# EAGLE design untitled (EAGLE 8.6.1)
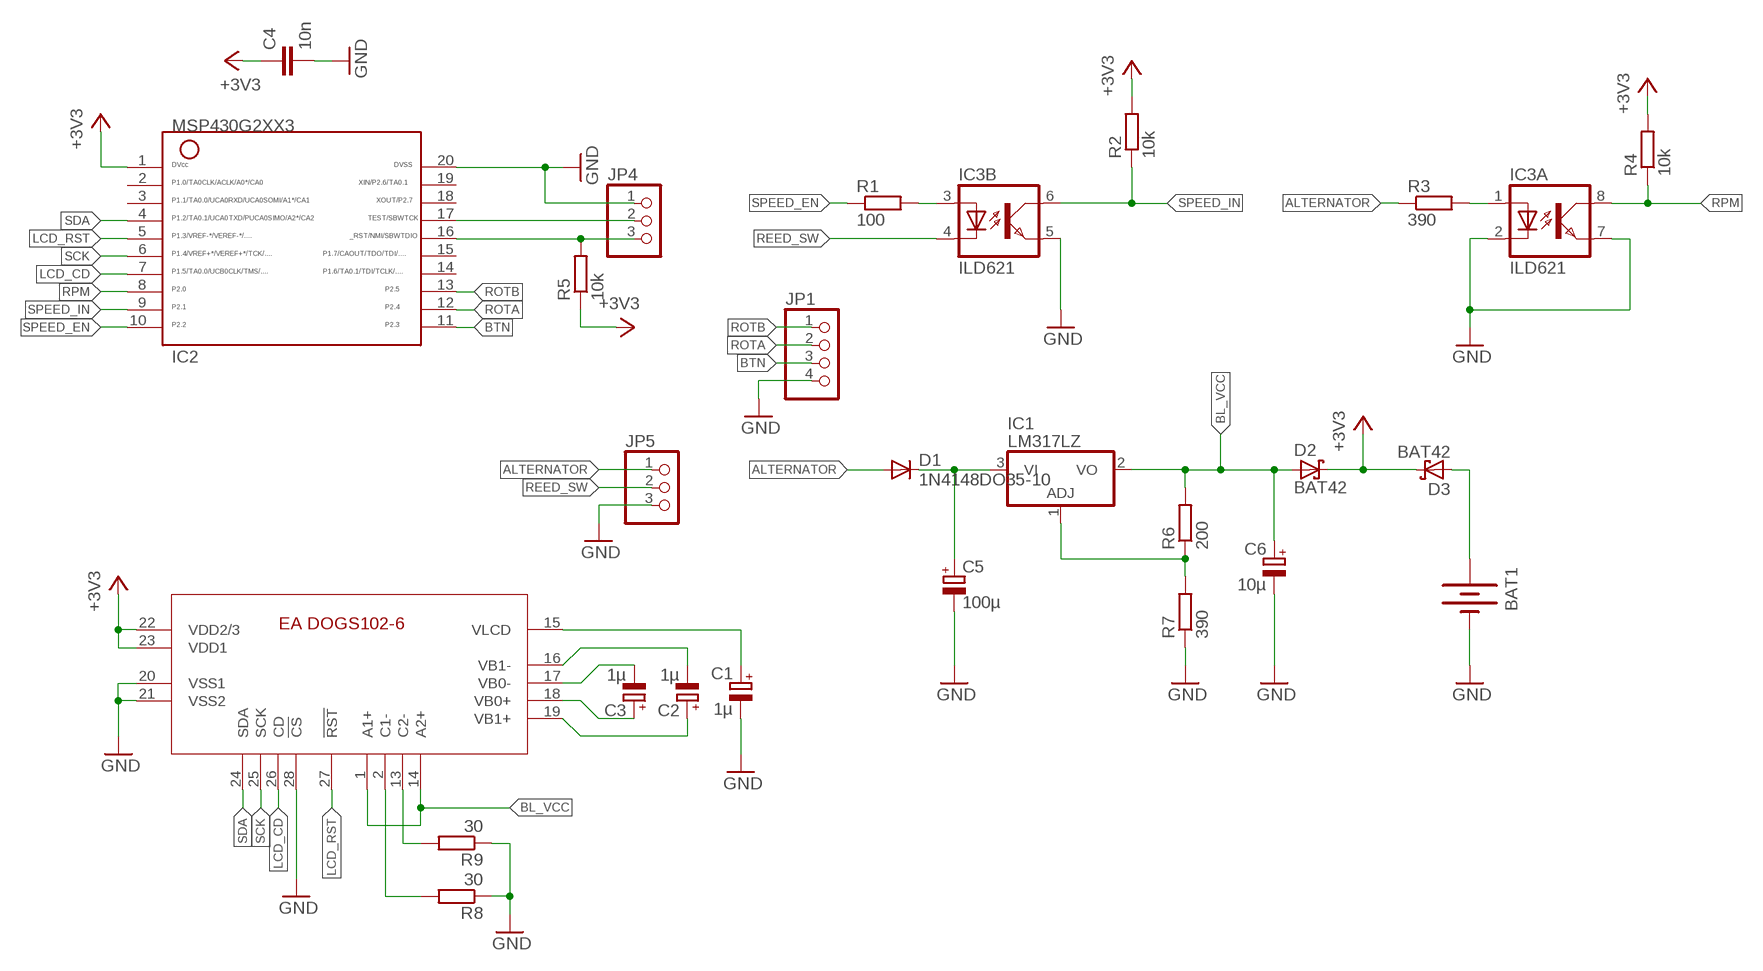
[diagram p0: schematic, sheet 1]

## Parts
BAT1  BATTERY20PTH  [BATTCOM_20MM_PTH]
C1  1µ  CPOL-EUE2-4  [E2-4]
C2  1µ  CPOL-EUE2-4  [E2-4]
C3  1µ  CPOL-EUE2-4  [E2-4]
C4  10n  C-EU050-024X044  [C050-024X044]
C5  100µ  CPOL-EUE2,5-6E  [E2,5-6E]
C6  10µ  CPOL-EUE2-4  [E2-4]
D1  1N4148DO35-10  [DO35-10]
D2  BAT42  [DO35-10]
D3  BAT42  [DO35-10]
IC1  LM317LZ  [TO92]
IC2  G2XX3---N20  [N20]
IC3  ILD621  [DIL08]
JP1  PINHD-1X4  [1X04]
JP4  PINHD-1X3  [1X03]
JP5  PINHD-1X3  [1X03]
R1  100  R-EU_0204/7  [0204/7]
R2  10k  R-EU_0204/7  [0204/7]
R3  390  R-EU_0204/7  [0204/7]
R4  10k  R-EU_0204/7  [0204/7]
R5  10k  R-EU_0204/7  [0204/7]
R6  200  R-EU_0204/7  [0204/7]
R7  390  R-EU_0204/7  [0204/7]
R8  30  R-EU_0204/7  [0204/7]
R9  30  R-EU_0204/7  [0204/7]
U$1  EA-DOG102-6  [EA_DOGS102-6]

## Nets
+3V3: C4.1 D2.C D3.C IC2.1 R2.2 R4.2 R5.1 U$1.22(VDD2/3) U$1.23(VDD1)
ALTERNATOR: D1.A JP5.1 R3.1
BL_VCC: C6.+ D2.A IC1.2(VO) R6.2 U$1.1(A1+) U$1.14(A2+)
BTN: IC2.11 JP1.3
GND: BAT1.2(-) C1.- C4.2 C5.- C6.- IC2.20 IC3.2(A:C) IC3.5(B:EMIT) IC3.7(A:EMIT) JP1.4 JP4.1 JP5.3 R7.1 R8.1 R9.1 U$1.20(VSS1) U$1.21(VSS2) U$1.28(!CS!)
LCD_CD: IC2.7 U$1.26(CD)
LCD_RST: IC2.5 U$1.27(!RST!)
N$3: IC2.16 JP4.3 R5.2
N$4: IC2.17 JP4.2
N$5: C1.+ U$1.15(VLCD)
N$6: IC3.3(B:A) R1.2
N$7: C3.- U$1.17(VB0-)
N$8: C3.+ U$1.18(VB0+)
N$9: C2.- U$1.16(VB1-)
N$10: IC1.1(ADJ) R6.1 R7.2
N$12: C5.+ D1.C IC1.3(VI)
N$14: BAT1.1(+) D3.A
N$15: IC3.1(A:A) R3.2
N$18: C2.+ U$1.19(VB1+)
N$19: R8.2 U$1.2(C1-)
N$20: R9.2 U$1.13(C2-)
REED_SW: IC3.4(B:C) JP5.2
ROTA: IC2.12 JP1.2
ROTB: IC2.13 JP1.1
RPM: IC2.8 IC3.8(A:COL) R4.1
SCK: IC2.6 U$1.25(SCK)
SDA: IC2.4 U$1.24(SDA)
SPEED_EN: IC2.10 R1.1
SPEED_IN: IC2.9 IC3.6(B:COL) R2.1
Unconnected: IC2.2 IC2.3 IC2.14 IC2.15 IC2.18 IC2.19

## Library data of the parts
BAT1 = SparkFun-Electromechanical:BATTERY: Battery Holders Various common sizes : AA, AAA, 18650 (PRT-12895), 20mm coin cell and 12mm coin cell. 20MM_4LEGS, BATT-10373
C1-C3 C6 = rcl:CPOL-EU: POLARIZED CAPACITOR, European symbol
C4 = resistor:C-EU: CAPACITOR, European symbol
C5 = resistor:CPOL-EU: POLARIZED CAPACITOR, European symbol
D1 = diode:1N4148: DIODE high speed (Philips)
D2 D3 = diode:BAT42: DIODE barrier diode
IC1 = linear:*317: Positive VOLTAGE REGULATOR
IC2 = TI_MSP430_v16:G2XX3---N20: MSP430G2XX1 PDIP (N) 20 Pin Package
IC3 = optocoupler:ILD621: SIEMENS OPTO COUPLER; MF: VISHAY/TELEFUNKEN; MPN: ILD621; OC_FARNELL: 1020151; OC_NEWARK: 58K1678
JP1 = pinhead:PINHD-1X4: PIN HEADER
JP4 JP5 = pinhead:PINHD-1X3: PIN HEADER
R1-R9 = resistor:R-EU_: RESISTOR, European symbol
U$1 = ea_v6:EA-DOG102-6

## Board
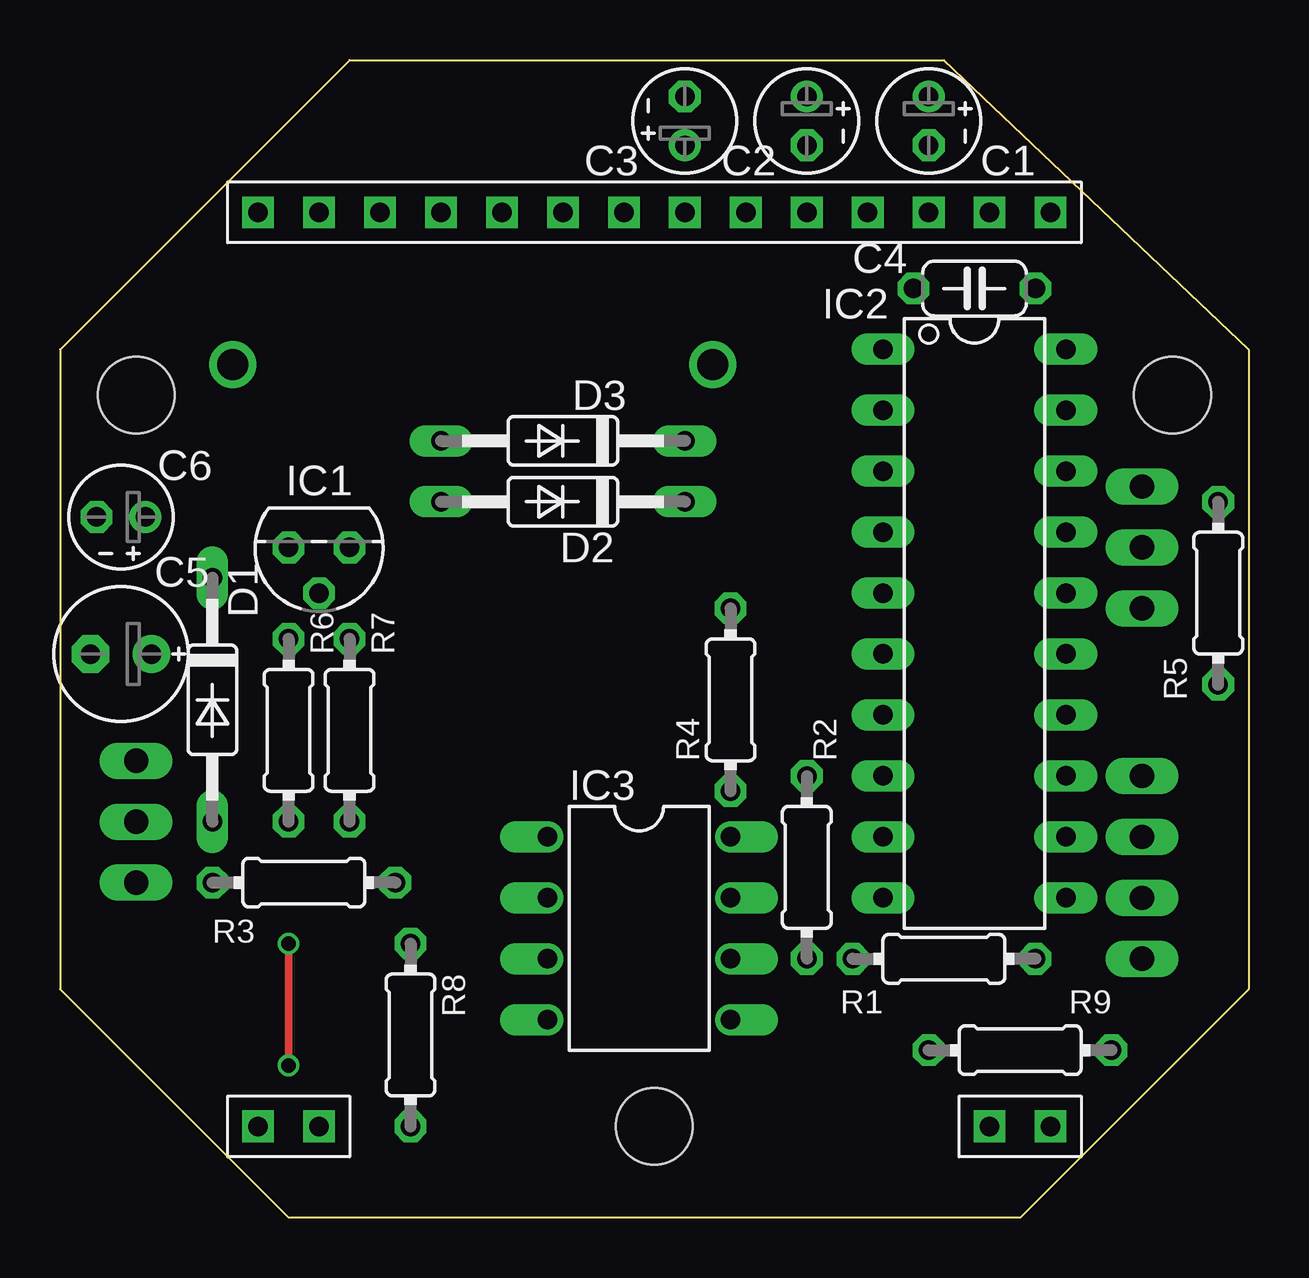
[diagram p1: board, top side]
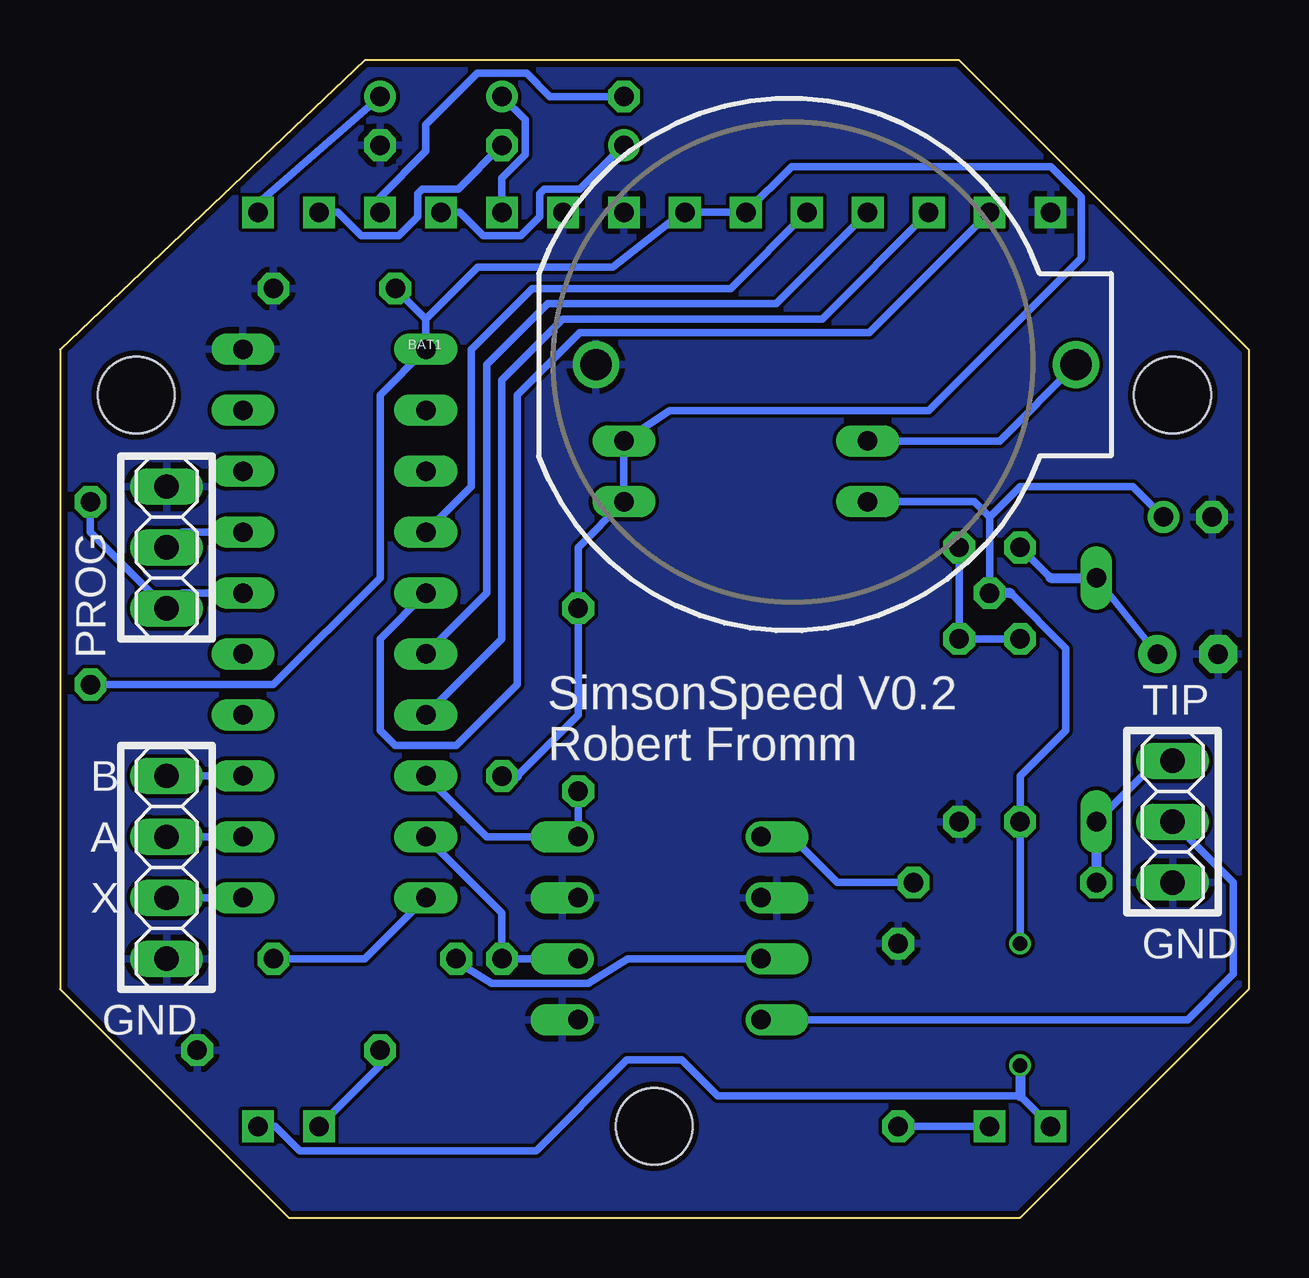
[diagram p2: board, bottom side, seen from below]

Size 49.53 x 48.26 mm. Coordinates in mm from the lower left corner, seen from the top.
Outline: 9.53,0 0,9.53 0,36.2 12.06,48.26 36.83,48.26 49.53,36.2 49.53,9.53 40,0 9.53,0
Copper layers (1*16): Top 0.035mm / dielectric 1.5mm / Bottom 0.035mm
Design rules "dirt_cheap_dirty_boards.v1.1": minimum track width 6mil, minimum drill 12mil, track to track 6mil, track to pad 6mil, pad to pad 6mil, via to via 6mil, smd to smd 0mil, copper to edge 10mil, drill to drill 10mil, minimum pad ring 10mil, minimum via ring 6mil, stop-mask expansion 2mil, vias tented up to drill 25mil, thermal gap 10mil
Holes 3.2 mm at 3.17,34.29 46.35,34.29 24.77,3.81

### Footprints (pad centres in the part's own frame; a part is rotated, then mirrored left to right if it is on the bottom)
BATTCOM_20MM_PTH = drill 1.3: 1 11.85,0; 2 -8.15,0
E2-4 = drill 0.813 pad 1.27: + -1.016,0 | drill 0.813 pad 1.27 octagon: - 1.016,0
C050-024X044 = drill 0.813 octagon: 1 -2.54,0; 2 2.54,0
E2,5-6E = drill 0.813 pad 1.575: + -1.27,0 | drill 0.813 pad 1.575 octagon: - 1.27,0
DO35-10 = drill 0.813 long: A 5.08,0; C -5.08,0
TO92 = drill 0.813 octagon: 1 -1.27,0; 2 0,1.905; 3 1.27,0
N20 = drill 0.813 long: 1 -11.435,-3.81; 2 -8.895,-3.81; 3 -6.355,-3.81; 4 -3.815,-3.81; 5 -1.275,-3.81; 6 1.265,-3.81; 7 3.805,-3.81; 8 6.345,-3.81; 9 8.885,-3.81; 10 11.425,-3.81; 11 11.425,3.81; 12 8.885,3.81; 13 6.345,3.81; 14 3.805,3.81; 15 1.265,3.81; 16 -1.275,3.81; 17 -3.815,3.81; 18 -6.355,3.81; 19 -8.895,3.81; 20 -11.435,3.81
DIL08 = drill 0.813 offset: 1 -3.81,-3.81; 2 -1.27,-3.81; 3 1.27,-3.81; 4 3.81,-3.81; 5 3.81,3.81; 6 1.27,3.81; 7 -1.27,3.81; 8 -3.81,3.81
1X04 = drill 1.016 long: 1 -3.81,0; 2 -1.27,0; 3 1.27,0; 4 3.81,0
1X03 = drill 1.016 long: 1 -2.54,0; 2 0,0; 3 2.54,0
0204/7 = drill 0.813 octagon: 1 -3.81,0; 2 3.81,0
EA_DOGS102-6 = drill 0.813 square: 1 0,0; 2 2.54,0; 13 30.48,0; 14 33.02,0; 15 33.02,38.1; 16 30.48,38.1; 17 27.94,38.1; 18 25.4,38.1; 19 22.86,38.1; 20 20.32,38.1; 21 17.78,38.1; 22 15.24,38.1; 23 12.7,38.1; 24 10.16,38.1; 25 7.62,38.1; 26 5.08,38.1; 27 2.54,38.1; 28 0,38.1

### Placement (x,y rotation side)
BAT1  19.05,35.56 0 bottom
C1  36.2,45.72 270 top
C2  31.12,45.72 270 top
C3  26.04,45.72 90 top
C4  38.1,38.74 0 top
C5  2.54,23.5 180 top
C6  2.54,29.21 180 top
D1  6.35,21.59 270 top
D2  20.96,29.84 180 top
D3  20.96,32.38 180 top
IC1  10.79,27.94 180 top
IC2  38.1,24.77 270 top
IC3  24.13,12.06 270 top
JP1  45.09,14.61 270 bottom
JP4  45.09,27.94 270 bottom
JP5  3.17,16.51 270 bottom
R1  36.83,10.79 180 top
R2  31.12,14.61 90 top
R3  10.16,13.97 0 top
R4  27.94,21.59 90 top
R5  48.26,26.04 90 top
R6  9.53,20.32 270 top
R7  12.06,20.32 90 top
R8  14.61,7.62 270 top
R9  40,6.98 180 top
U$1  8.26,3.81 0 top

### Tracks (layer width: path | path; a pad name or v marks a point on that pad's centre or on a via)
+3V3
  Bottom 0.305: 34.29,37.47 IC2.1 36.2,34.3 36.2,26.67 40.64,22.22 R5.1 | 34.29,37.47 C4.1 | 34.29,37.47 32.13,39.62 26.5,39.62 23.58,41.91 U$1.22 U$1.23 19.05,43.82 8.26,43.82 6.98,42.55 6.98,40.01 13.33,33.66 24.13,33.66 D3.C D2.C 27.94,27.94 R4.2 27.94,20.95 30.48,18.41
  Bottom 0.406: R2.2 30.48,18.41
ALTERNATOR
  Bottom 0.305: D1.A 3.81,19.05 JP5.1
  Bottom 0.406: D1.A R3.1
BL_VCC  (via drill 0.6)
  Top 0.305: v9.53,11.43 v9.53,6.35
  Bottom 0.305: U$1.14 40.56,3.81 39.54,2.79 29.7,2.79 25.91,6.58 23.62,6.58 22.12,5.08 9.53,5.08 U$1.1 | 9.92,26.04 7.62,23.73 7.62,20.32 9.53,18.41 R6.2 v9.53,11.43 | 10.79,29.21 9.53,30.48 4.83,30.48 C6.+ | IC1.2 10.79,29.21 | D2.A 11.43,29.84 10.79,29.21
  Bottom 0.406: 9.92,26.04 IC1.2 | v9.53,6.35 9.53,5.08
BTN
  Bottom 0.305: IC2.11 JP1.3
GND
  pour Bottom: 12.06,48.26 0,36.2 0,9.53 9.53,0 40,0 49.53,9.53 49.53,36.2 36.83,48.26
LCD_CD
  Bottom 0.305: IC2.7 31.12,24.13 31.12,34.93 28.58,37.47 17.78,37.47 U$1.26
LCD_RST
  Bottom 0.305: IC2.5 36.2,24.13 36.2,20.32 35.56,19.68 33.02,19.68 30.48,22.22 30.48,34.29 27.88,36.89 15.81,36.89 U$1.27
N$3
  Bottom 0.305: IC2.16 44.45,26.04 JP4.3 48.26,28.57 R5.2
N$4
  Bottom 0.305: IC2.17 44.45,28.58 JP4.2
N$5
  Bottom 0.305: C1.+ 41.27,42.29 U$1.15
N$6
  Bottom 0.305: R1.2 33.19,10.79 31.54,9.78 27.52,9.78 25.87,10.79 IC3.3
N$7
  Bottom 0.305: C3.- 29.12,46.74 30.08,47.7 32.15,47.7 34.29,45.56 34.29,44.45 36.2,42.55 U$1.17
N$8
  Bottom 0.305: C3.+ 27.86,42.88 29.36,42.88 29.54,42.7 29.54,41.73 30.33,40.95 31.9,40.95 32.87,41.91 U$1.18
N$9
  Bottom 0.305: C2.- 32.94,42.88 34.44,42.88 34.62,42.7 34.62,41.73 35.41,40.95 36.98,40.95 37.95,41.91 U$1.16
N$10
  Bottom 0.305: R6.1 R7.2 IC1.1
N$12
  Bottom 0.305: D1.C C5.+ | IC1.3 8.26,26.67
  Bottom 0.406: 8.26,26.67 D1.C
N$14
  Bottom 0.305: BAT1.1 10.38,32.38 D3.A
N$15
  Bottom 0.305: R3.2 17.15,13.97 19.05,15.88 IC3.1
N$18
  Bottom 0.305: U$1.19 31.12,43.34 30.15,44.3 30.15,45.77 C2.+
N$19
  Bottom 0.305: U$1.2 R8.2
N$20
  Bottom 0.305: R9.2 36.2,6.35 U$1.13
REED_SW
  Bottom 0.305: IC3.4 2.54,8.26 0.64,10.16 0.64,13.97 JP5.2
ROTA
  Bottom 0.305: IC2.12 JP1.2
ROTB
  Bottom 0.305: JP1.1 IC2.13
RPM
  Bottom 0.305: IC2.8 31.75,15.88 IC3.8 R4.1
SCK
  Bottom 0.305: IC2.6 31.76,26.04 31.75,26.04 31.75,35.56 29.21,38.1 19.69,38.1 U$1.25
SDA
  Bottom 0.305: IC2.4 32.38,30.48 32.38,36.2 29.85,38.74 21.59,38.74 U$1.24
SPEED_EN
  Bottom 0.305: IC2.10 36.84,10.79 R1.1
SPEED_IN
  Bottom 0.305: IC3.6 R2.1 31.12,12.71 IC2.9

### Text on the board
bNames: PROG | TIP | SimsonSpeed V0.2 / Robert Fromm | B | A | X | GND | GND